# Altium schematic sheet Others.SchDoc
size A4; SheetNumber: 5; SheetTotal: 5
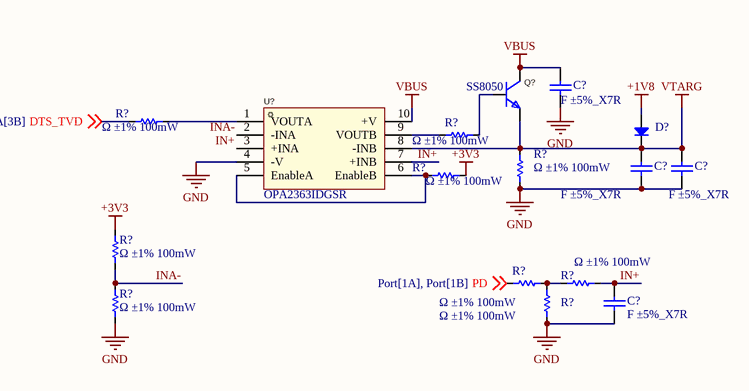
[diagram p0: Others.SchDoc]

## Parts
(Parts that share a designator on the sheet are numbered #1, #2 ... from top to bottom, then left to right.)
C?#1  F ±5%_X7R  [C0805]
C?#2  F ±5%_X7R  [C0805]
C?#3  F ±5%_X7R  [C0805]
C?#4  F ±5%_X7R  [C0805]
D?  1N4148  [SOD-523F]  (value not drawn)
Q?  SS8050  [SOT-23-3_L2.9-W1.6-P1.90-LS2.8-BR]
R?#1  Ω ±1% 100mW  [R0603]
R?#2  Ω ±1% 100mW  [R0603]
R?#3  Ω ±1% 100mW  [R0603]
R?#4  Ω ±1% 100mW  [R0603]
R?#5  Ω ±1% 100mW  [R0603]
R?#6  Ω ±1% 100mW  [R0603]
R?#7  Ω ±1% 100mW  [R0603]
R?#8  Ω ±1% 100mW  [R0603]
R?#9  Ω ±1% 100mW  [R0603]
U?  OPA2363IDGSR  [VSSOP-10_L3.0-W3.0-P0.50-LS4.9-BL]

## Nets
+1V8: D?.2(A)
+3V3: R?#4.2 R?#5.2
GND: C?#1.1 C?#2.1 C?#3.1 C?#4.1 R?#3.2 R?#8.1 R?#9.1 U?.4(-V)
VBUS: C?#1.2 Q?.3(C) U?.10(+V)
VTARG: C?#2.2 C?#3.2 D?.1(K) Q?.2(E) R?#3.1 U?.8(-INB)
DTS_TVD: R?#1.1 ; off-sheet DTS_TVD
IN+: C?#4.2 R?#6.2 U?.3(+INA) U?.7(+INB)
INA-: R?#5.1 R?#8.2 U?.2(-INA)
PD: R?#7.2 ; off-sheet PD
NetQ?_1: Q?.1(B) R?#2.1
NetR?#1_2: R?#1.2 U?.1(VOUTA)
NetR?#2_2: R?#2.2 U?.9(VOUTB)
NetR?#4_1: R?#4.1 U?.5(EnableA) U?.6(EnableB)
NetR?#6_1: R?#6.1 R?#7.1 R?#9.2

## Library data of the parts
C?#1-C?#4 = Cap: Capacitor; Published: 8-Jun-2000; LatestRevisionDate: 17-Jul-2002; LatestRevisionNote: Re-released for DXP Platform.; PackageReference: RAD-0.3; Publisher: Altium Limited; PackageDescription: Radial Cap, Thru-Hole; 2 Leads; 0.3 in Pin Spacing
D? = 1N4148: High Conductance Fast Diode; Published: 8-Jun-2000; LatestRevisionDate: 17-Jul-2002; LatestRevisionNote: Re-released for DXP Platform.; DatasheetVersion: 1997; PackageReference: DO-35; Publisher: Altium Limited; PackageDescription: Diode, Axial; Body 3.8 x 1.9 mm (LxDia. max), Lead Dia. 0.53 mm (max); Code_JEDEC: DO-204-AH; ComponentLink1Description: Manufacturer Link; ComponentLink1URL: http://www.fairchildsemi.com/; ComponentLink2Description: Datasheet; ComponentLink2URL: http://www.fairchildsemi.com/ds/1N%2F1N4148.pdf
Q? = SS8050: Manufacturer: CJ(江苏长电/长晶); Symbol: SS8050_C2150; Add into BOM: yes; Transistor Type: NPN; Collector-Emitter Breakdown Voltage (Vceo): 25V; Collector Current (Ic): 1.5A; Power Dissipation (Pd): 300mW; Collector Cut-Off Current (Icbo): 100nA; Collector-Emitter Saturation Voltage (VCE(sat)@Ic,Ib): 500mV@800mA,80mA; DC Current Gain (hFE@Ic,Vce): 200@100mA,1V; Transition Frequency (fT): 100MHz; Name: SS8050; Device: SS8050_C2150; LCSC Part Name: NPN 25V 1.5A Y1 200-350; Supplier Part: C2150; Manufacturer Part: SS8050; Supplier Footprint: SOT-23; JLCPCB Part Class: Basic Part; Datasheet: https://atta.szlcsc.com/upload/public/pdf/source/20230322/AEE86F4B043774EFF80CAEA14A37D9E9.pdf; Supplier: LCSC; Convert to PCB: yes; Operating Temperature: +150℃@(Tj)
R?#1-R?#9 = Res: Resistor; Published: 8-Jun-2000; LatestRevisionDate: 17-Jul-2002; LatestRevisionNote: Re-released for DXP Platform.; PackageReference: AXIAL-0.3; Publisher: Altium Limited; PackageDescription: Axial Device, Thru-Hole; 2 Leads; 0.3 in Pin Spacing
U? = OPA2363: Manufacturer: TI(德州仪器); Add into BOM: yes; Number of Circuits: 2; Gain Bandwidth Product(GBP): 7MHz; Slew Rate(SR): 5V/us; Name: OPA2363IDGSR; Symbol: OPA2363IDGSR; Device: OPA2363IDGSR; LCSC Part Name: OPA2363IDGSR; Supplier Part: C181294; Manufacturer Part: OPA2363IDGSR; Supplier Footprint: VSSOP-10-0.5mm; JLCPCB Part Class: Extended Part; Datasheet: https://atta.szlcsc.com/upload/public/pdf/source/20180227/C181294_15196973833841369920.pdf; Supplier: LCSC; Convert to PCB: yes